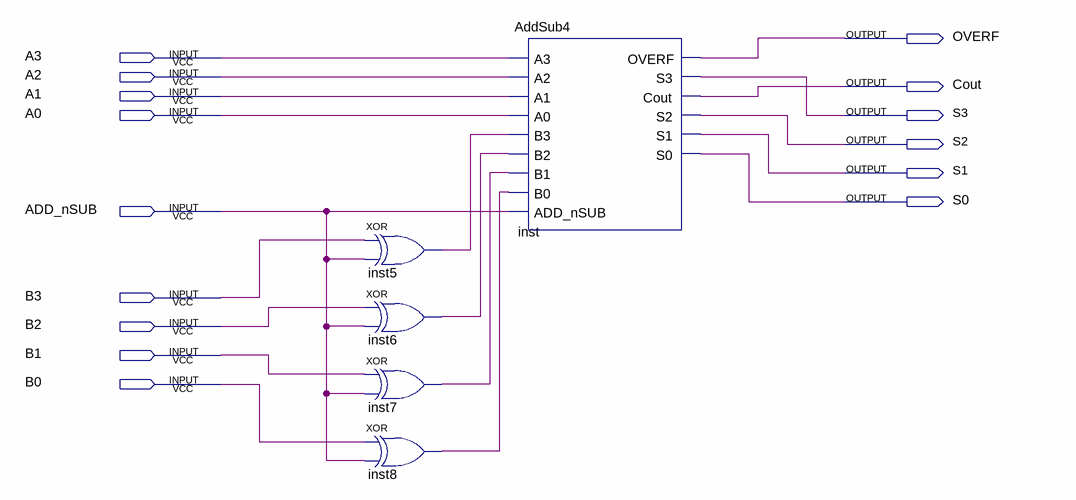
[diagram p0: schematic sheet]
// Quartus schematic AddSubDemo.bdf as structural Verilog: 5 symbols, 15 pins
module AddSubDemo (
  input  A3,
  input  A2,
  input  A1,
  input  A0,
  input  ADD_nSUB,
  input  B3,
  input  B2,
  input  B1,
  input  B0,
  output OVERF,
  output Cout,
  output S3,
  output S2,
  output S1,
  output S0
);

  wire inst5_out, inst6_out, inst7_out, inst8_out;

  xor inst5 (inst5_out, B3, ADD_nSUB);
  xor inst6 (inst6_out, B2, ADD_nSUB);
  xor inst7 (inst7_out, B1, ADD_nSUB);
  xor inst8 (inst8_out, B0, ADD_nSUB);
  AddSub4 inst (
    .A3(A3), .A2(A2), .A1(A1), .A0(A0), .B3(inst5_out), .B2(inst6_out), .B1(inst7_out), .B0(inst8_out),
    .ADD_nSUB(ADD_nSUB), .OVERF(OVERF), .S3(S3), .Cout(Cout), .S2(S2), .S1(S1), .S0(S0));
endmodule
